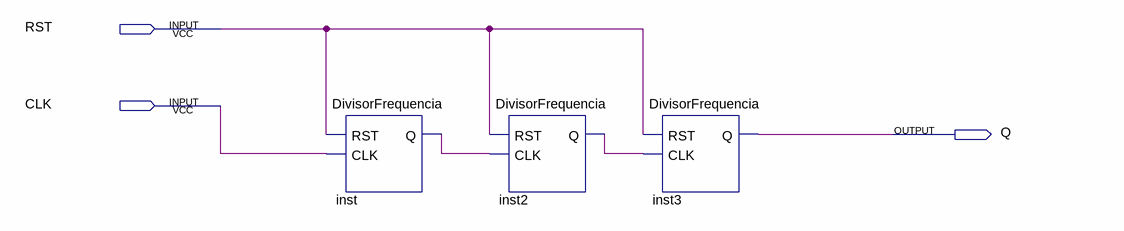
[diagram p0: schematic sheet]
// Quartus schematic DivisorFrequencia24.bdf as structural Verilog: 3 symbols, 3 pins
module DivisorFrequencia24 (
  input  RST,
  input  CLK,
  output Q
);

  wire inst2_q, inst_q;

  DivisorFrequencia inst (.RST(RST), .CLK(CLK), .Q(inst_q));
  DivisorFrequencia inst2 (.RST(RST), .CLK(inst_q), .Q(inst2_q));
  DivisorFrequencia inst3 (.RST(RST), .CLK(inst2_q), .Q(Q));
endmodule
